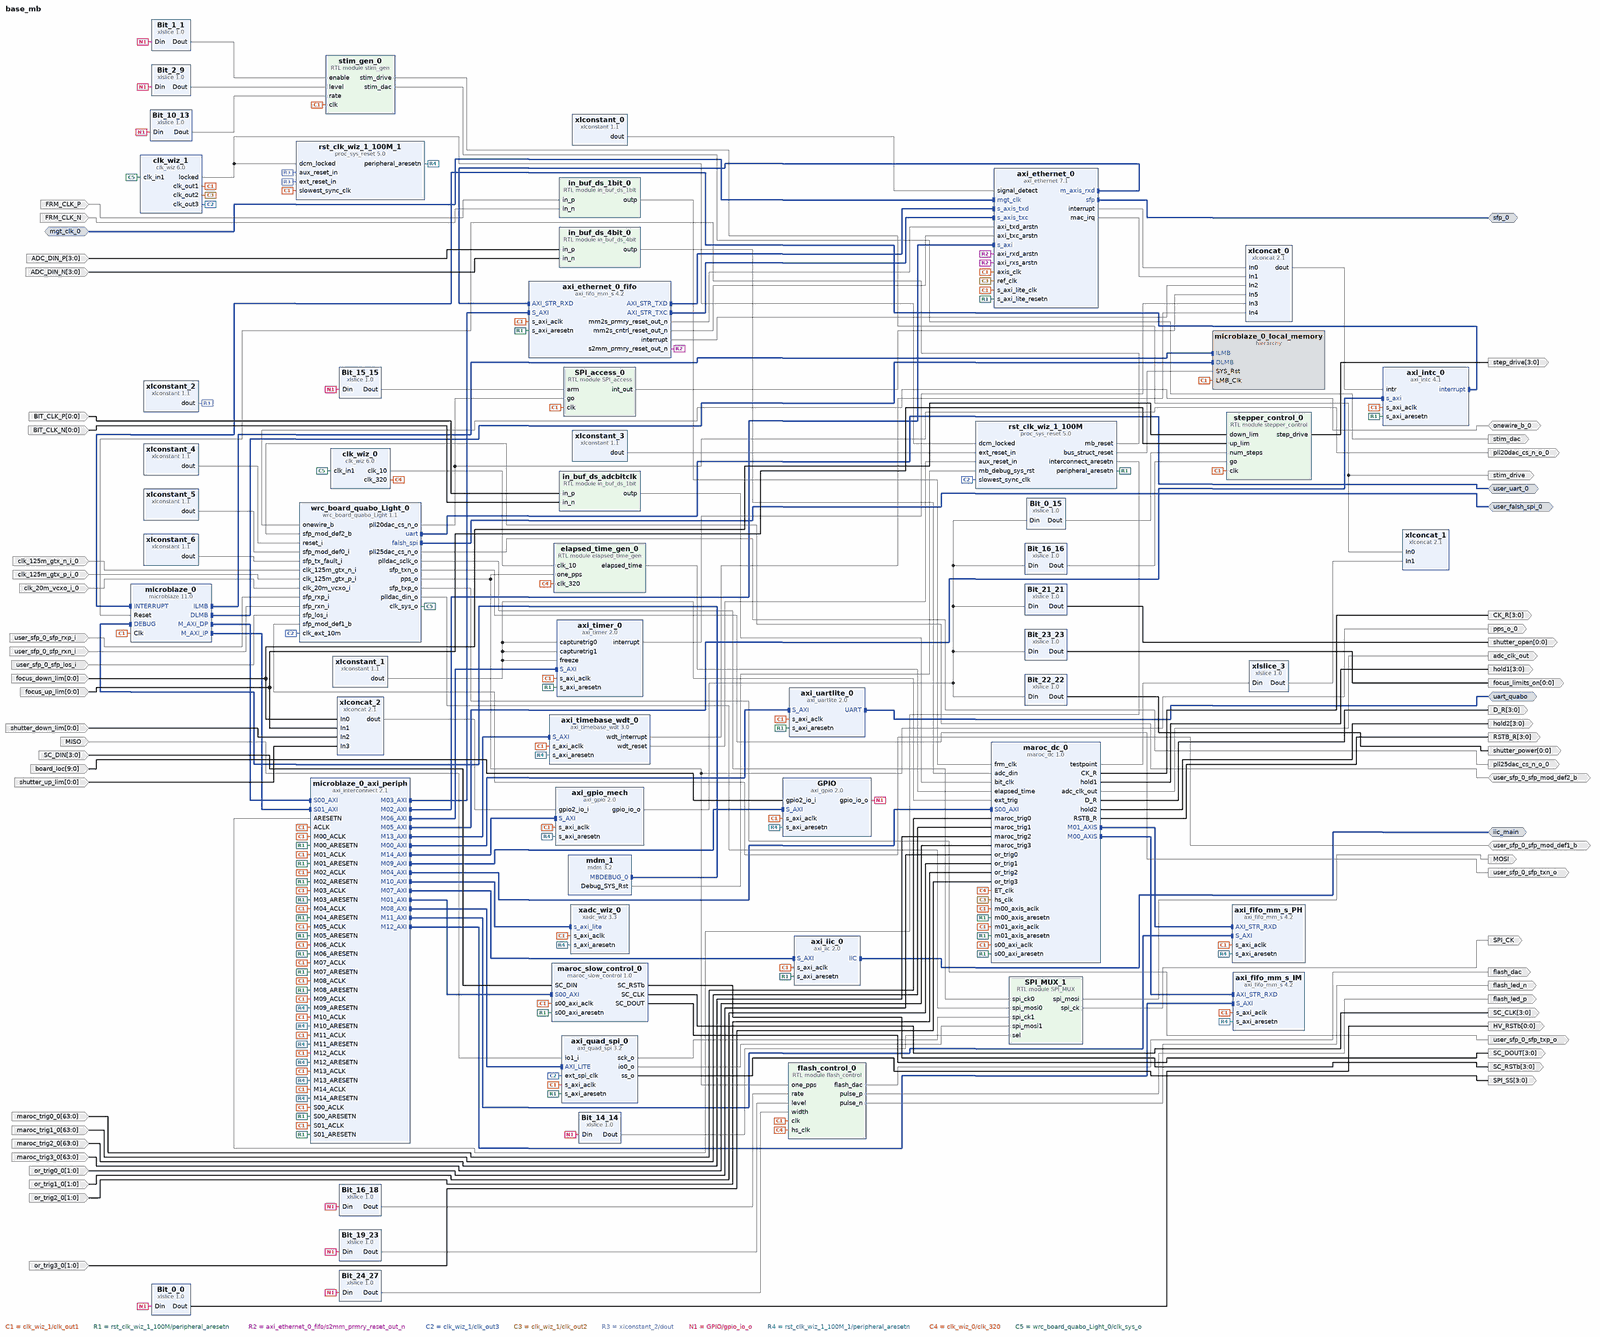
[diagram p0: block diagram of the top level, whole]
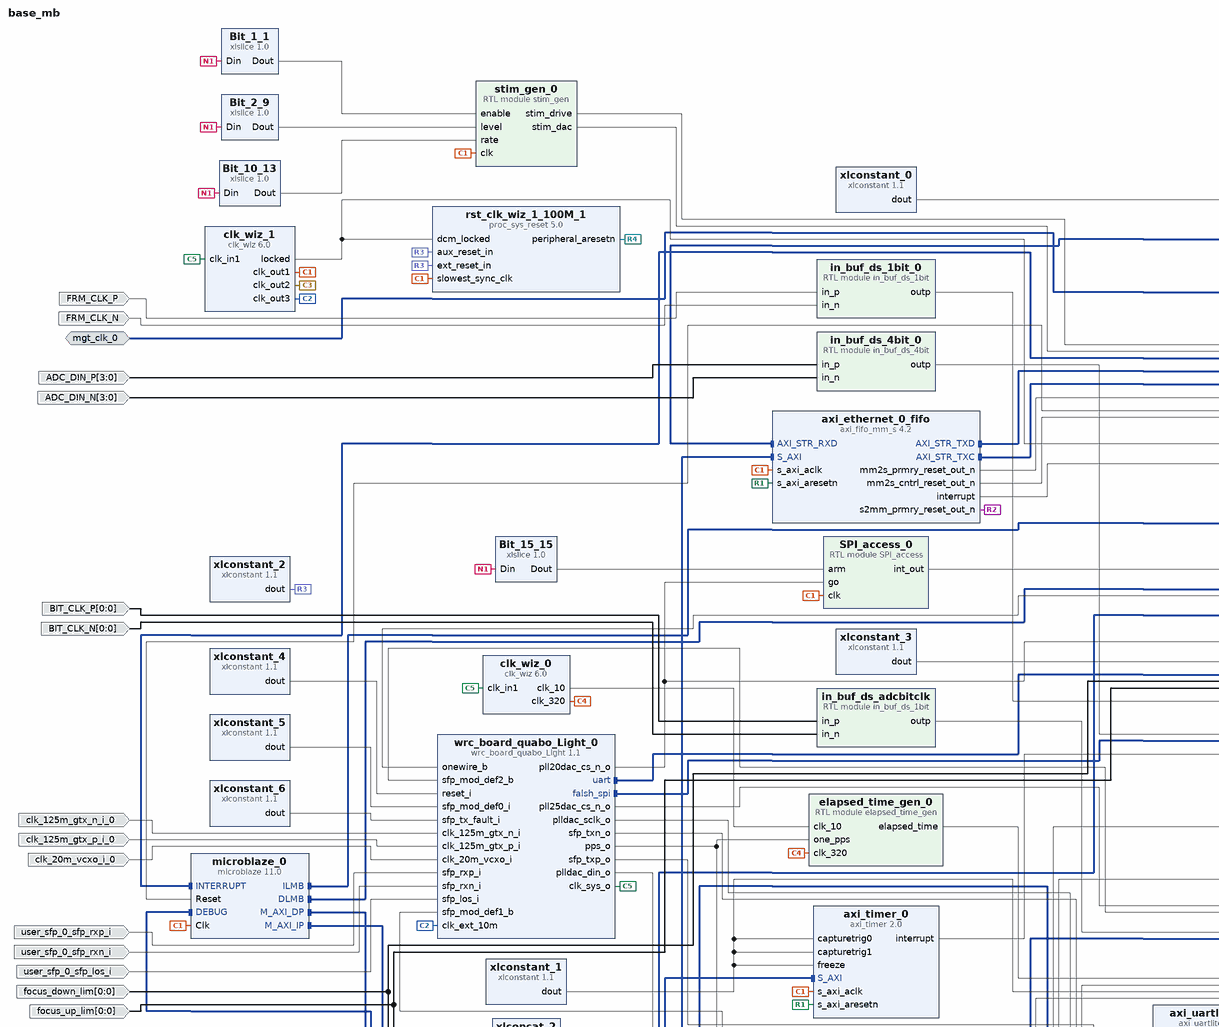
[diagram p1: block diagram of the top level, upper left part]
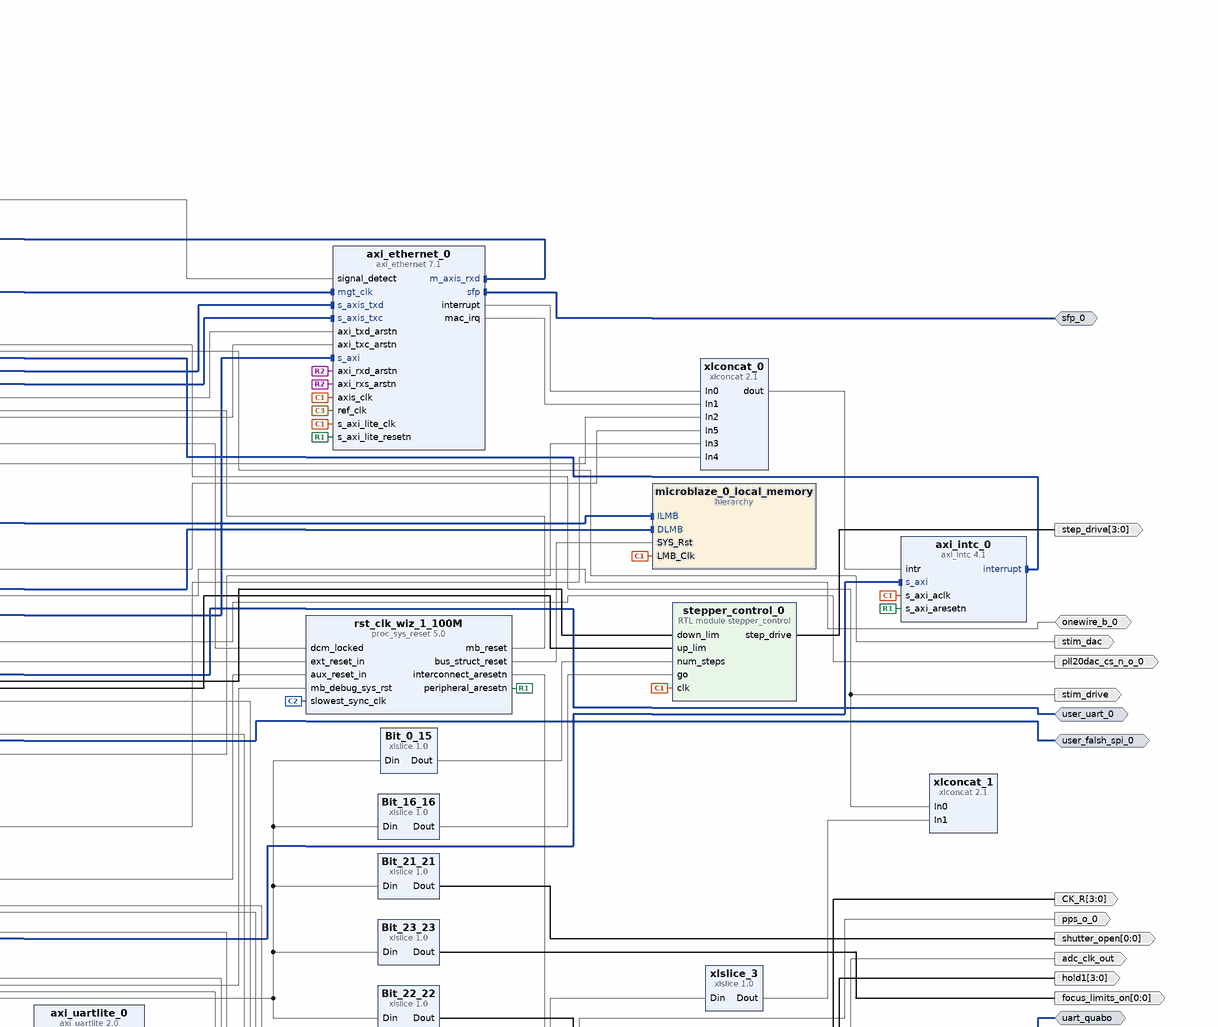
[diagram p2: block diagram of the top level, upper right part]
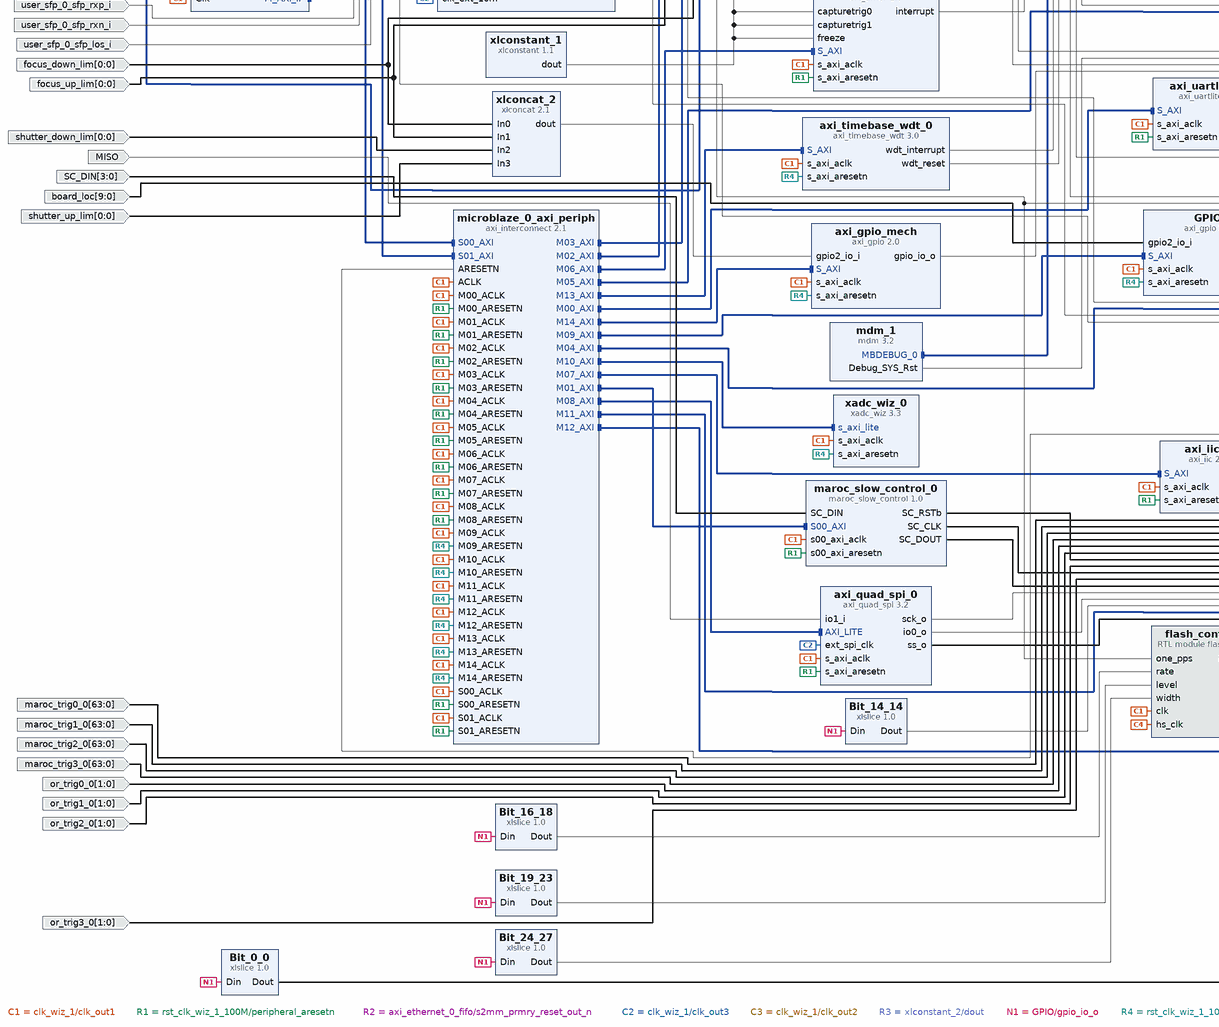
[diagram p3: block diagram of the top level, lower left part]
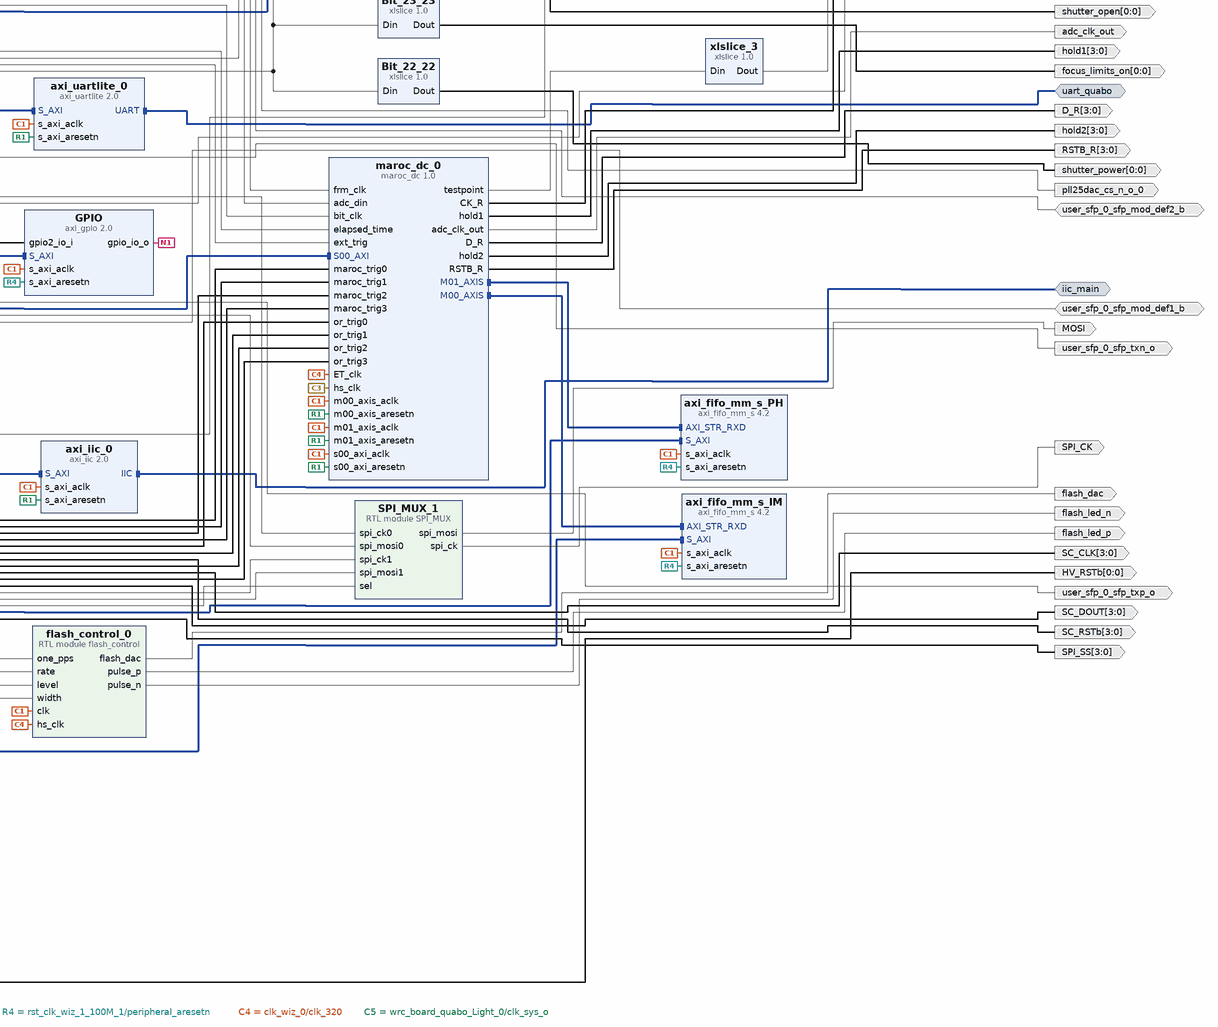
[diagram p4: block diagram of the top level, lower right part]
# Vivado block design base_mb, xc7k160tffg676-1, Vivado 2018.3_AR71948
create_bd_design base_mb

create_bd_intf_port -mode Slave -vlnv xilinx.com:interface:diff_clock_rtl:1.0 mgt_clk_0
create_bd_intf_port -mode Master -vlnv xilinx.com:interface:iic_rtl:1.0 iic_main
create_bd_intf_port -mode Master -vlnv xilinx.com:interface:sfp_rtl:1.0 sfp_0
create_bd_intf_port -mode Master -vlnv xilinx.com:interface:uart_rtl:1.0 uart_quabo
create_bd_intf_port -mode Master -vlnv user.org:user:falsh_spi_rtl:1.1 user_falsh_spi_0
create_bd_intf_port -mode Master -vlnv user.org:user:uart_rtl:1.0 user_uart_0
create_bd_port -dir I MISO
create_bd_port -dir O MOSI
create_bd_port -dir O SPI_CK
create_bd_port -dir O -from 3 -to 0 SC_RSTb
create_bd_port -dir O -from 3 -to 0 SC_DOUT
create_bd_port -dir O -from 3 -to 0 -type clk SC_CLK
create_bd_port -dir O -from 3 -to 0 hold1
create_bd_port -dir O -from 3 -to 0 hold2
create_bd_port -dir O -from 3 -to 0 CK_R
create_bd_port -dir O -from 3 -to 0 RSTB_R
create_bd_port -dir O -from 3 -to 0 D_R
create_bd_port -dir O adc_clk_out
create_bd_port -dir I -from 3 -to 0 SC_DIN
create_bd_port -dir I -from 63 -to 0 maroc_trig0_0
create_bd_port -dir I -from 63 -to 0 maroc_trig1_0
create_bd_port -dir I -from 63 -to 0 maroc_trig2_0
create_bd_port -dir I -from 63 -to 0 maroc_trig3_0
create_bd_port -dir I -from 1 -to 0 or_trig0_0
create_bd_port -dir I -from 1 -to 0 or_trig1_0
create_bd_port -dir I -from 1 -to 0 or_trig2_0
create_bd_port -dir I -from 1 -to 0 or_trig3_0
create_bd_port -dir O -from 0 -to 0 HV_RSTb
create_bd_port -dir O stim_drive
create_bd_port -dir O stim_dac
create_bd_port -dir I -from 9 -to 0 board_loc
create_bd_port -dir I FRM_CLK_P
create_bd_port -dir I FRM_CLK_N
create_bd_port -dir I -from 3 -to 0 ADC_DIN_P
create_bd_port -dir I -from 3 -to 0 ADC_DIN_N
create_bd_port -dir I -from 0 -to 0 -type clk BIT_CLK_P
set_property -dict {CONFIG.FREQ_HZ 60000000} [get_bd_ports BIT_CLK_P]
create_bd_port -dir I -from 0 -to 0 -type clk BIT_CLK_N
set_property -dict {CONFIG.FREQ_HZ 60000000} [get_bd_ports BIT_CLK_N]
create_bd_port -dir I clk_125m_gtx_n_i_0
create_bd_port -dir I clk_125m_gtx_p_i_0
create_bd_port -dir I clk_20m_vcxo_i_0
create_bd_port -dir IO onewire_b_0
create_bd_port -dir O pll20dac_cs_n_o_0
create_bd_port -dir O pll25dac_cs_n_o_0
create_bd_port -dir O pps_o_0
create_bd_port -dir O -from 3 -to 0 SPI_SS
create_bd_port -dir O user_sfp_0_sfp_txn_o
create_bd_port -dir I user_sfp_0_sfp_rxp_i
create_bd_port -dir O user_sfp_0_sfp_txp_o
create_bd_port -dir I user_sfp_0_sfp_rxn_i
create_bd_port -dir IO user_sfp_0_sfp_mod_def2_b
create_bd_port -dir IO user_sfp_0_sfp_mod_def1_b
create_bd_port -dir I user_sfp_0_sfp_los_i
create_bd_port -dir O flash_dac
create_bd_port -dir O flash_led_p
create_bd_port -dir O flash_led_n
create_bd_port -dir O -from 0 -to 0 shutter_open
create_bd_port -dir O -from 0 -to 0 shutter_power
create_bd_port -dir O -from 0 -to 0 focus_limits_on
create_bd_port -dir O -from 3 -to 0 step_drive
create_bd_port -dir I -from 0 -to 0 focus_down_lim
create_bd_port -dir I -from 0 -to 0 focus_up_lim
create_bd_port -dir I -from 0 -to 0 shutter_down_lim
create_bd_port -dir I -from 0 -to 0 shutter_up_lim

create_bd_cell -type hier microblaze_0_local_memory
create_bd_cell -type ip -vlnv xilinx.com:ip:xlconcat:2.1 xlconcat_0
set_property -dict {CONFIG.NUM_PORTS 6 CONFIG.dout_width 6} [get_bd_cells xlconcat_0]
create_bd_cell -type ip -vlnv xilinx.com:ip:xlslice:1.0 Bit_0_0
set_property -dict {CONFIG.DIN_FROM 0 CONFIG.DIN_TO 0 CONFIG.DIN_WIDTH 32} [get_bd_cells Bit_0_0]
create_bd_cell -type ip -vlnv xilinx.com:ip:xlslice:1.0 Bit_1_1
set_property -dict {CONFIG.DIN_FROM 1 CONFIG.DIN_TO 1 CONFIG.DIN_WIDTH 32 CONFIG.DOUT_WIDTH 1} [get_bd_cells Bit_1_1]
create_bd_cell -type ip -vlnv xilinx.com:ip:xlslice:1.0 Bit_2_9
set_property -dict {CONFIG.DIN_FROM 9 CONFIG.DIN_TO 2 CONFIG.DIN_WIDTH 32 CONFIG.DOUT_WIDTH 8} [get_bd_cells Bit_2_9]
create_bd_cell -type ip -vlnv xilinx.com:ip:xlslice:1.0 xlslice_3
set_property -dict {CONFIG.DIN_FROM 5 CONFIG.DIN_TO 3 CONFIG.DIN_WIDTH 6 CONFIG.DOUT_WIDTH 3} [get_bd_cells xlslice_3]
create_bd_cell -type module -reference in_buf_ds_1bit in_buf_ds_1bit_0
create_bd_cell -type module -reference in_buf_ds_4bit in_buf_ds_4bit_0
create_bd_cell -type module -reference elapsed_time_gen elapsed_time_gen_0
create_bd_cell -type module -reference in_buf_ds_1bit in_buf_ds_adcbitclk
create_bd_cell -type ip -vlnv xilinx.com:ip:xlconcat:2.1 xlconcat_1
set_property -dict {CONFIG.IN0_WIDTH 1 CONFIG.IN1_WIDTH 3} [get_bd_cells xlconcat_1]
create_bd_cell -type module -reference stim_gen stim_gen_0
create_bd_cell -type ip -vlnv xilinx.com:ip:xlslice:1.0 Bit_10_13
set_property -dict {CONFIG.DIN_FROM 13 CONFIG.DIN_TO 10 CONFIG.DIN_WIDTH 32 CONFIG.DOUT_WIDTH 4} [get_bd_cells Bit_10_13]
create_bd_cell -type ip -vlnv xilinx.com:ip:axi_ethernet:7.1 axi_ethernet_0
set_property -dict {CONFIG.PHY_TYPE 1000BaseX} [get_bd_cells axi_ethernet_0]
create_bd_cell -type ip -vlnv xilinx.com:ip:axi_fifo_mm_s:4.2 axi_ethernet_0_fifo
set_property -dict [list \
  CONFIG.C_HAS_AXIS_TKEEP true \
  CONFIG.C_RX_FIFO_DEPTH 4096 \
  CONFIG.C_RX_FIFO_PE_THRESHOLD 10 \
  CONFIG.C_RX_FIFO_PF_THRESHOLD 4000 \
  CONFIG.C_TX_FIFO_DEPTH 4096 \
  CONFIG.C_TX_FIFO_PE_THRESHOLD 10 \
  CONFIG.C_TX_FIFO_PF_THRESHOLD 4000 \
] [get_bd_cells axi_ethernet_0_fifo]
create_bd_cell -type ip -vlnv xilinx.com:ip:axi_fifo_mm_s:4.2 axi_fifo_mm_s_PH
set_property -dict [list \
  CONFIG.C_RX_FIFO_DEPTH 4096 \
  CONFIG.C_RX_FIFO_PF_THRESHOLD 3840 \
  CONFIG.C_USE_TX_CTRL 0 \
  CONFIG.C_USE_TX_DATA 0 \
] [get_bd_cells axi_fifo_mm_s_PH]
create_bd_cell -type ip -vlnv xilinx.com:ip:axi_fifo_mm_s:4.2 axi_fifo_mm_s_IM
set_property -dict [list \
  CONFIG.C_RX_FIFO_DEPTH 4096 \
  CONFIG.C_RX_FIFO_PF_THRESHOLD 3840 \
  CONFIG.C_USE_TX_CTRL 0 \
  CONFIG.C_USE_TX_DATA 0 \
] [get_bd_cells axi_fifo_mm_s_IM]
create_bd_cell -type ip -vlnv xilinx.com:ip:axi_gpio:2.0 GPIO
set_property -dict [list \
  CONFIG.C_ALL_INPUTS_2 1 \
  CONFIG.C_ALL_OUTPUTS 1 \
  CONFIG.C_GPIO2_WIDTH 10 \
  CONFIG.C_GPIO_WIDTH 32 \
  CONFIG.C_IS_DUAL 1 \
] [get_bd_cells GPIO]
create_bd_cell -type ip -vlnv xilinx.com:ip:axi_iic:2.0 axi_iic_0
set_property -dict {CONFIG.IIC_BOARD_INTERFACE Custom CONFIG.USE_BOARD_FLOW true} [get_bd_cells axi_iic_0]
create_bd_cell -type ip -vlnv xilinx.com:ip:axi_intc:4.1 axi_intc_0
create_bd_cell -type ip -vlnv xilinx.com:ip:axi_quad_spi:3.2 axi_quad_spi_0
set_property -dict [list \
  CONFIG.C_FIFO_DEPTH 16 \
  CONFIG.C_NUM_SS_BITS 4 \
  CONFIG.C_S_AXI4_ID_WIDTH 0 \
  CONFIG.C_USE_STARTUP 0 \
  CONFIG.FIFO_INCLUDED 0 \
] [get_bd_cells axi_quad_spi_0]
create_bd_cell -type ip -vlnv xilinx.com:ip:axi_timebase_wdt:3.0 axi_timebase_wdt_0
create_bd_cell -type ip -vlnv xilinx.com:ip:axi_timer:2.0 axi_timer_0
set_property -dict {CONFIG.enable_timer2 0} [get_bd_cells axi_timer_0]
create_bd_cell -type ip -vlnv xilinx.com:ip:axi_uartlite:2.0 axi_uartlite_0
set_property -dict [list \
  CONFIG.C_BAUDRATE 115200 \
  CONFIG.UARTLITE_BOARD_INTERFACE Custom \
  CONFIG.USE_BOARD_FLOW true \
] [get_bd_cells axi_uartlite_0]
create_bd_cell -type ip -vlnv xilinx.com:ip:clk_wiz:6.0 clk_wiz_0
set_property -dict [list \
  CONFIG.CLKIN1_JITTER_PS 100.000 \
  CONFIG.CLKIN1_UI_JITTER 100.000 \
  CONFIG.CLKIN2_JITTER_PS 100.000 \
  CONFIG.CLKIN2_UI_JITTER 100.000 \
  CONFIG.CLKOUT1_JITTER 122.176 \
  CONFIG.CLKOUT1_PHASE_ERROR 113.630 \
  CONFIG.CLKOUT1_REQUESTED_OUT_FREQ 312.5 \
  CONFIG.CLKOUT2_JITTER 165.729 \
  CONFIG.CLKOUT2_PHASE_ERROR 113.630 \
  CONFIG.CLKOUT2_REQUESTED_OUT_FREQ 62.5000 \
  CONFIG.CLKOUT2_REQUESTED_PHASE 0.000 \
  CONFIG.CLKOUT2_USED true \
  CONFIG.CLKOUT3_JITTER 877.934 \
  CONFIG.CLKOUT3_PHASE_ERROR 874.060 \
  CONFIG.CLKOUT3_REQUESTED_OUT_FREQ 100.000 \
  CONFIG.CLKOUT3_USED false \
  CONFIG.CLK_OUT1_PORT clk_320 \
  CONFIG.CLK_OUT2_PORT clk_10 \
  CONFIG.CLK_OUT3_PORT clk_out3 \
  CONFIG.JITTER_OPTIONS PS \
  CONFIG.MMCM_CLKFBOUT_MULT_F 15.000 \
  CONFIG.MMCM_CLKIN1_PERIOD 16.000 \
  CONFIG.MMCM_CLKIN2_PERIOD 10.0 \
  CONFIG.MMCM_CLKOUT0_DIVIDE_F 3.000 \
  CONFIG.MMCM_CLKOUT1_DIVIDE 15 \
  CONFIG.MMCM_CLKOUT1_PHASE 0.000 \
  CONFIG.MMCM_CLKOUT2_DIVIDE 1 \
  CONFIG.MMCM_DIVCLK_DIVIDE 1 \
  CONFIG.MMCM_REF_JITTER1 0.006 \
  CONFIG.MMCM_REF_JITTER2 0.010 \
  CONFIG.NUM_OUT_CLKS 2 \
  CONFIG.PRIM_IN_FREQ 62.5 \
  CONFIG.PRIM_SOURCE Single_ended_clock_capable_pin \
  CONFIG.USE_INCLK_STOPPED true \
  CONFIG.USE_RESET false \
] [get_bd_cells clk_wiz_0]
create_bd_cell -type ip -vlnv xilinx.com:ip:clk_wiz:6.0 clk_wiz_1
set_property -dict [list \
  CONFIG.CLKIN1_JITTER_PS 160.0 \
  CONFIG.CLKOUT1_JITTER 146.398 \
  CONFIG.CLKOUT1_PHASE_ERROR 117.286 \
  CONFIG.CLKOUT2_JITTER 128.566 \
  CONFIG.CLKOUT2_PHASE_ERROR 117.286 \
  CONFIG.CLKOUT2_REQUESTED_OUT_FREQ 200 \
  CONFIG.CLKOUT2_USED true \
  CONFIG.CLKOUT3_JITTER 247.343 \
  CONFIG.CLKOUT3_PHASE_ERROR 117.286 \
  CONFIG.CLKOUT3_REQUESTED_OUT_FREQ 10 \
  CONFIG.CLKOUT3_USED true \
  CONFIG.CLKOUT4_REQUESTED_OUT_FREQ 100.000 \
  CONFIG.MMCM_CLKFBOUT_MULT_F 16.000 \
  CONFIG.MMCM_CLKIN1_PERIOD 16.000 \
  CONFIG.MMCM_CLKIN2_PERIOD 10.0 \
  CONFIG.MMCM_CLKOUT1_DIVIDE 5 \
  CONFIG.MMCM_CLKOUT2_DIVIDE 100 \
  CONFIG.MMCM_DIVCLK_DIVIDE 1 \
  CONFIG.NUM_OUT_CLKS 3 \
  CONFIG.PRIM_IN_FREQ 62.5 \
  CONFIG.PRIM_SOURCE Single_ended_clock_capable_pin \
  CONFIG.USE_RESET false \
] [get_bd_cells clk_wiz_1]
create_bd_cell -type ip -vlnv xilinx.com:ip:mdm:3.2 mdm_1
create_bd_cell -type ip -vlnv xilinx.com:ip:microblaze:11.0 microblaze_0
set_property -dict [list \
  CONFIG.C_ADDR_TAG_BITS 0 \
  CONFIG.C_DCACHE_ADDR_TAG 0 \
  CONFIG.C_DEBUG_ENABLED 1 \
  CONFIG.C_D_AXI 1 \
  CONFIG.C_D_LMB 1 \
  CONFIG.C_I_AXI 1 \
  CONFIG.C_I_LMB 1 \
  CONFIG.C_USE_DCACHE 0 \
  CONFIG.C_USE_ICACHE 0 \
] [get_bd_cells microblaze_0]
create_bd_cell -type ip -vlnv xilinx.com:ip:axi_interconnect:2.1 microblaze_0_axi_periph
set_property -dict {CONFIG.NUM_MI 15 CONFIG.NUM_SI 2} [get_bd_cells microblaze_0_axi_periph]
create_bd_cell -type ip -vlnv xilinx.com:ip:proc_sys_reset:5.0 rst_clk_wiz_1_100M
set_property -dict {CONFIG.C_AUX_RESET_HIGH 1} [get_bd_cells rst_clk_wiz_1_100M]
create_bd_cell -type ip -vlnv xilinx.com:ip:proc_sys_reset:5.0 rst_clk_wiz_1_100M_1
create_bd_cell -type ip -vlnv xilinx.com:ip:xadc_wiz:3.3 xadc_wiz_0
set_property -dict [list \
  CONFIG.CHANNEL_ENABLE_TEMPERATURE true \
  CONFIG.CHANNEL_ENABLE_VBRAM true \
  CONFIG.CHANNEL_ENABLE_VCCAUX true \
  CONFIG.CHANNEL_ENABLE_VCCINT true \
  CONFIG.CHANNEL_ENABLE_VP_VN false \
  CONFIG.ENABLE_RESET false \
  CONFIG.EXTERNAL_MUX_CHANNEL VP_VN \
  CONFIG.INTERFACE_SELECTION Enable_AXI \
  CONFIG.OT_ALARM false \
  CONFIG.SEQUENCER_MODE Continuous \
  CONFIG.SINGLE_CHANNEL_SELECTION VCCINT \
  CONFIG.USER_TEMP_ALARM false \
  CONFIG.VCCAUX_ALARM false \
  CONFIG.VCCINT_ALARM false \
  CONFIG.XADC_STARUP_SELECTION channel_sequencer \
] [get_bd_cells xadc_wiz_0]
create_bd_cell -type ip -vlnv xilinx.com:ip:xlconstant:1.1 xlconstant_0
create_bd_cell -type ip -vlnv xilinx.com:ip:xlconstant:1.1 xlconstant_1
set_property -dict {CONFIG.CONST_VAL 0} [get_bd_cells xlconstant_1]
create_bd_cell -type ip -vlnv xilinx.com:ip:xlconstant:1.1 xlconstant_2
create_bd_cell -type ip -vlnv xilinx.com:ip:xlconstant:1.1 xlconstant_3
set_property -dict {CONFIG.CONST_VAL 1} [get_bd_cells xlconstant_3]
create_bd_cell -type ip -vlnv xilinx.com:user:maroc_dc:1.0 maroc_dc_0
create_bd_cell -type ip -vlnv xilinx.com:user:maroc_slow_control:1.0 maroc_slow_control_0
create_bd_cell -type ip -vlnv xilinx.com:ip:xlslice:1.0 Bit_14_14
set_property -dict {CONFIG.DIN_FROM 14 CONFIG.DIN_TO 14 CONFIG.DIN_WIDTH 32 CONFIG.DOUT_WIDTH 1} [get_bd_cells Bit_14_14]
create_bd_cell -type module -reference SPI_MUX SPI_MUX_1
create_bd_cell -type ip -vlnv xilinx.com:ip:xlslice:1.0 Bit_15_15
set_property -dict {CONFIG.DIN_FROM 15 CONFIG.DIN_TO 15 CONFIG.DIN_WIDTH 32 CONFIG.DOUT_WIDTH 1} [get_bd_cells Bit_15_15]
create_bd_cell -type ip -vlnv xilinx.com:ip:xlconstant:1.1 xlconstant_4
set_property -dict {CONFIG.CONST_VAL 1} [get_bd_cells xlconstant_4]
create_bd_cell -type ip -vlnv xilinx.com:ip:xlconstant:1.1 xlconstant_5
set_property -dict {CONFIG.CONST_VAL 0} [get_bd_cells xlconstant_5]
create_bd_cell -type ip -vlnv xilinx.com:ip:xlconstant:1.1 xlconstant_6
create_bd_cell -type module -reference SPI_access SPI_access_0
create_bd_cell -type ip -vlnv user.org:user:wrc_board_quabo_Light:1.1 wrc_board_quabo_Light_0
set_property -dict {CONFIG.g_dpram_initf /home/wei/Desktop/wrc_phy16_sdb.bram} [get_bd_cells wrc_board_quabo_Light_0]
create_bd_cell -type module -reference flash_control flash_control_0
create_bd_cell -type module -reference stepper_control stepper_control_0
create_bd_cell -type ip -vlnv xilinx.com:ip:xlslice:1.0 Bit_16_18
set_property -dict {CONFIG.DIN_FROM 18 CONFIG.DIN_TO 16 CONFIG.DIN_WIDTH 32 CONFIG.DOUT_WIDTH 3} [get_bd_cells Bit_16_18]
create_bd_cell -type ip -vlnv xilinx.com:ip:xlslice:1.0 Bit_19_23
set_property -dict {CONFIG.DIN_FROM 23 CONFIG.DIN_TO 19 CONFIG.DIN_WIDTH 32 CONFIG.DOUT_WIDTH 5} [get_bd_cells Bit_19_23]
create_bd_cell -type ip -vlnv xilinx.com:ip:xlslice:1.0 Bit_24_27
set_property -dict {CONFIG.DIN_FROM 27 CONFIG.DIN_TO 24 CONFIG.DIN_WIDTH 32 CONFIG.DOUT_WIDTH 4} [get_bd_cells Bit_24_27]
create_bd_cell -type ip -vlnv xilinx.com:ip:axi_gpio:2.0 axi_gpio_mech
set_property -dict [list \
  CONFIG.C_ALL_INPUTS_2 1 \
  CONFIG.C_ALL_OUTPUTS 1 \
  CONFIG.C_GPIO2_WIDTH 4 \
  CONFIG.C_IS_DUAL 1 \
] [get_bd_cells axi_gpio_mech]
create_bd_cell -type ip -vlnv xilinx.com:ip:xlslice:1.0 Bit_0_15
set_property -dict {CONFIG.DIN_FROM 15 CONFIG.DIN_TO 0 CONFIG.DIN_WIDTH 32 CONFIG.DOUT_WIDTH 16} [get_bd_cells Bit_0_15]
create_bd_cell -type ip -vlnv xilinx.com:ip:xlslice:1.0 Bit_16_16
set_property -dict {CONFIG.DIN_FROM 16 CONFIG.DIN_TO 16 CONFIG.DIN_WIDTH 32 CONFIG.DOUT_WIDTH 1} [get_bd_cells Bit_16_16]
create_bd_cell -type ip -vlnv xilinx.com:ip:xlconcat:2.1 xlconcat_2
set_property -dict {CONFIG.NUM_PORTS 4} [get_bd_cells xlconcat_2]
create_bd_cell -type ip -vlnv xilinx.com:ip:xlslice:1.0 Bit_21_21
set_property -dict {CONFIG.DIN_FROM 21 CONFIG.DIN_TO 21 CONFIG.DIN_WIDTH 32 CONFIG.DOUT_WIDTH 1} [get_bd_cells Bit_21_21]
create_bd_cell -type ip -vlnv xilinx.com:ip:xlslice:1.0 Bit_22_22
set_property -dict {CONFIG.DIN_FROM 22 CONFIG.DIN_TO 22 CONFIG.DIN_WIDTH 32 CONFIG.DOUT_WIDTH 1} [get_bd_cells Bit_22_22]
create_bd_cell -type ip -vlnv xilinx.com:ip:xlslice:1.0 Bit_23_23
set_property -dict {CONFIG.DIN_FROM 23 CONFIG.DIN_TO 23 CONFIG.DIN_WIDTH 32 CONFIG.DOUT_WIDTH 1} [get_bd_cells Bit_23_23]

# ---- hierarchy /microblaze_0_local_memory ----
current_bd_instance /microblaze_0_local_memory
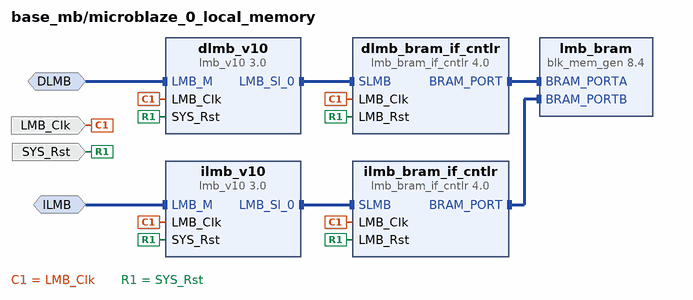
[diagram p5: block diagram inside /microblaze_0_local_memory]
create_bd_intf_pin -mode MirroredMaster -vlnv xilinx.com:interface:lmb_rtl:1.0 DLMB
create_bd_intf_pin -mode MirroredMaster -vlnv xilinx.com:interface:lmb_rtl:1.0 ILMB
create_bd_pin -dir I -type clk LMB_Clk
create_bd_pin -dir I -type rst SYS_Rst

create_bd_cell -type ip -vlnv xilinx.com:ip:lmb_v10:3.0 dlmb_v10
create_bd_cell -type ip -vlnv xilinx.com:ip:lmb_v10:3.0 ilmb_v10
create_bd_cell -type ip -vlnv xilinx.com:ip:lmb_bram_if_cntlr:4.0 dlmb_bram_if_cntlr
set_property -dict {CONFIG.C_ECC 0} [get_bd_cells dlmb_bram_if_cntlr]
create_bd_cell -type ip -vlnv xilinx.com:ip:lmb_bram_if_cntlr:4.0 ilmb_bram_if_cntlr
set_property -dict {CONFIG.C_ECC 0} [get_bd_cells ilmb_bram_if_cntlr]
create_bd_cell -type ip -vlnv xilinx.com:ip:blk_mem_gen:8.4 lmb_bram
set_property -dict [list \
  CONFIG.Enable_B Use_ENB_Pin \
  CONFIG.Memory_Type True_Dual_Port_RAM \
  CONFIG.Port_B_Clock 100 \
  CONFIG.Port_B_Enable_Rate 100 \
  CONFIG.Port_B_Write_Rate 50 \
  CONFIG.Use_RSTB_Pin true \
  CONFIG.use_bram_block BRAM_Controller \
] [get_bd_cells lmb_bram]

# ---- connections ----

current_bd_instance /microblaze_0_local_memory
connect_bd_intf_net -intf_net microblaze_0_dlmb_cntlr [get_bd_intf_pins dlmb_bram_if_cntlr/BRAM_PORT] [get_bd_intf_pins lmb_bram/BRAM_PORTA]
connect_bd_intf_net -intf_net microblaze_0_dlmb_bus [get_bd_intf_pins dlmb_v10/LMB_Sl_0] [get_bd_intf_pins dlmb_bram_if_cntlr/SLMB]
connect_bd_intf_net -intf_net microblaze_0_ilmb [get_bd_intf_pins ILMB] [get_bd_intf_pins ilmb_v10/LMB_M]
connect_bd_intf_net -intf_net microblaze_0_ilmb_bus [get_bd_intf_pins ilmb_v10/LMB_Sl_0] [get_bd_intf_pins ilmb_bram_if_cntlr/SLMB]
connect_bd_intf_net -intf_net microblaze_0_ilmb_cntlr [get_bd_intf_pins ilmb_bram_if_cntlr/BRAM_PORT] [get_bd_intf_pins lmb_bram/BRAM_PORTB]
connect_bd_intf_net -intf_net microblaze_0_dlmb [get_bd_intf_pins DLMB] [get_bd_intf_pins dlmb_v10/LMB_M]
connect_bd_net -net microblaze_0_Clk [get_bd_pins LMB_Clk] \
  [get_bd_pins dlmb_v10/LMB_Clk] [get_bd_pins ilmb_v10/LMB_Clk] [get_bd_pins dlmb_bram_if_cntlr/LMB_Clk] \
  [get_bd_pins ilmb_bram_if_cntlr/LMB_Clk]
connect_bd_net [get_bd_pins SYS_Rst] \
  [get_bd_pins dlmb_v10/SYS_Rst] [get_bd_pins ilmb_v10/SYS_Rst] [get_bd_pins dlmb_bram_if_cntlr/LMB_Rst] \
  [get_bd_pins ilmb_bram_if_cntlr/LMB_Rst]
set_property HDL_ATTRIBUTE.BMM_INFO_ADDRESS_SPACE {byte  0x00000000 32 > base_mb microblaze_0_local_memory/lmb_bram} [get_bd_cells dlmb_bram_if_cntlr]
set_property HDL_ATTRIBUTE.KEEP_HIERARCHY yes [get_bd_cells dlmb_bram_if_cntlr]

current_bd_instance /
connect_bd_intf_net [get_bd_intf_pins axi_fifo_mm_s_PH/AXI_STR_RXD] [get_bd_intf_pins maroc_dc_0/M01_AXIS]
connect_bd_intf_net [get_bd_intf_pins mdm_1/MBDEBUG_0] [get_bd_intf_pins microblaze_0/DEBUG]
connect_bd_intf_net [get_bd_intf_ports user_uart_0] [get_bd_intf_pins wrc_board_quabo_Light_0/uart]
connect_bd_intf_net [get_bd_intf_pins microblaze_0_axi_periph/M02_AXI] [get_bd_intf_pins axi_ethernet_0/s_axi]
connect_bd_intf_net [get_bd_intf_pins axi_ethernet_0_fifo/AXI_STR_TXD] [get_bd_intf_pins axi_ethernet_0/s_axis_txd]
connect_bd_intf_net [get_bd_intf_ports uart_quabo] [get_bd_intf_pins axi_uartlite_0/UART]
connect_bd_intf_net [get_bd_intf_ports sfp_0] [get_bd_intf_pins axi_ethernet_0/sfp]
connect_bd_intf_net [get_bd_intf_pins microblaze_0/ILMB] [get_bd_intf_pins microblaze_0_local_memory/ILMB]
connect_bd_intf_net [get_bd_intf_pins microblaze_0_axi_periph/M09_AXI] [get_bd_intf_pins GPIO/S_AXI]
connect_bd_intf_net [get_bd_intf_pins microblaze_0/M_AXI_DP] [get_bd_intf_pins microblaze_0_axi_periph/S00_AXI]
connect_bd_intf_net [get_bd_intf_pins microblaze_0_axi_periph/M01_AXI] [get_bd_intf_pins maroc_slow_control_0/S00_AXI]
connect_bd_intf_net [get_bd_intf_pins axi_ethernet_0_fifo/AXI_STR_TXC] [get_bd_intf_pins axi_ethernet_0/s_axis_txc]
connect_bd_intf_net [get_bd_intf_pins axi_intc_0/interrupt] [get_bd_intf_pins microblaze_0/INTERRUPT]
connect_bd_intf_net [get_bd_intf_pins microblaze_0_axi_periph/M03_AXI] [get_bd_intf_pins axi_ethernet_0_fifo/S_AXI]
connect_bd_intf_net [get_bd_intf_pins microblaze_0_axi_periph/M07_AXI] [get_bd_intf_pins axi_iic_0/S_AXI]
connect_bd_intf_net [get_bd_intf_pins microblaze_0_axi_periph/M05_AXI] [get_bd_intf_pins axi_intc_0/s_axi]
connect_bd_intf_net [get_bd_intf_pins microblaze_0/M_AXI_IP] [get_bd_intf_pins microblaze_0_axi_periph/S01_AXI]
connect_bd_intf_net -intf_net mgt_clk_0_1 [get_bd_intf_ports mgt_clk_0] [get_bd_intf_pins axi_ethernet_0/mgt_clk]
connect_bd_intf_net [get_bd_intf_pins microblaze_0_axi_periph/M10_AXI] [get_bd_intf_pins xadc_wiz_0/s_axi_lite]
connect_bd_intf_net [get_bd_intf_pins microblaze_0_axi_periph/M04_AXI] [get_bd_intf_pins maroc_dc_0/S00_AXI]
connect_bd_intf_net [get_bd_intf_pins microblaze_0_axi_periph/M13_AXI] [get_bd_intf_pins axi_timebase_wdt_0/S_AXI]
connect_bd_intf_net [get_bd_intf_pins axi_ethernet_0_fifo/AXI_STR_RXD] [get_bd_intf_pins axi_ethernet_0/m_axis_rxd]
connect_bd_intf_net [get_bd_intf_pins microblaze_0/DLMB] [get_bd_intf_pins microblaze_0_local_memory/DLMB]
connect_bd_intf_net [get_bd_intf_ports iic_main] [get_bd_intf_pins axi_iic_0/IIC]
connect_bd_intf_net [get_bd_intf_pins microblaze_0_axi_periph/M00_AXI] [get_bd_intf_pins axi_uartlite_0/S_AXI]
connect_bd_intf_net [get_bd_intf_pins microblaze_0_axi_periph/M06_AXI] [get_bd_intf_pins axi_timer_0/S_AXI]
connect_bd_intf_net [get_bd_intf_pins microblaze_0_axi_periph/M08_AXI] [get_bd_intf_pins axi_quad_spi_0/AXI_LITE]
connect_bd_intf_net [get_bd_intf_ports user_falsh_spi_0] [get_bd_intf_pins wrc_board_quabo_Light_0/falsh_spi]
connect_bd_intf_net [get_bd_intf_pins axi_fifo_mm_s_IM/AXI_STR_RXD] [get_bd_intf_pins maroc_dc_0/M00_AXIS]
connect_bd_intf_net [get_bd_intf_pins microblaze_0_axi_periph/M11_AXI] [get_bd_intf_pins axi_fifo_mm_s_PH/S_AXI]
connect_bd_intf_net [get_bd_intf_pins microblaze_0_axi_periph/M12_AXI] [get_bd_intf_pins axi_fifo_mm_s_IM/S_AXI]
connect_bd_intf_net [get_bd_intf_pins microblaze_0_axi_periph/M14_AXI] [get_bd_intf_pins axi_gpio_mech/S_AXI]
connect_bd_net -net microblaze_0_Clk [get_bd_pins clk_wiz_1/clk_out1] \
  [get_bd_pins stim_gen_0/clk] [get_bd_pins microblaze_0_local_memory/LMB_Clk] [get_bd_pins axi_ethernet_0/s_axi_lite_clk] \
  [get_bd_pins axi_ethernet_0/axis_clk] [get_bd_pins axi_ethernet_0_fifo/s_axi_aclk] \
  [get_bd_pins axi_fifo_mm_s_PH/s_axi_aclk] [get_bd_pins axi_fifo_mm_s_IM/s_axi_aclk] [get_bd_pins GPIO/s_axi_aclk] \
  [get_bd_pins axi_iic_0/s_axi_aclk] [get_bd_pins axi_intc_0/s_axi_aclk] [get_bd_pins axi_quad_spi_0/s_axi_aclk] \
  [get_bd_pins axi_timebase_wdt_0/s_axi_aclk] [get_bd_pins axi_timer_0/s_axi_aclk] [get_bd_pins axi_uartlite_0/s_axi_aclk] \
  [get_bd_pins microblaze_0/Clk] [get_bd_pins microblaze_0_axi_periph/ACLK] [get_bd_pins microblaze_0_axi_periph/S00_ACLK] \
  [get_bd_pins microblaze_0_axi_periph/S01_ACLK] [get_bd_pins microblaze_0_axi_periph/M00_ACLK] \
  [get_bd_pins microblaze_0_axi_periph/M01_ACLK] [get_bd_pins microblaze_0_axi_periph/M02_ACLK] \
  [get_bd_pins microblaze_0_axi_periph/M03_ACLK] [get_bd_pins microblaze_0_axi_periph/M04_ACLK] \
  [get_bd_pins microblaze_0_axi_periph/M05_ACLK] [get_bd_pins microblaze_0_axi_periph/M06_ACLK] \
  [get_bd_pins microblaze_0_axi_periph/M07_ACLK] [get_bd_pins microblaze_0_axi_periph/M08_ACLK] \
  [get_bd_pins microblaze_0_axi_periph/M09_ACLK] [get_bd_pins microblaze_0_axi_periph/M10_ACLK] \
  [get_bd_pins microblaze_0_axi_periph/M11_ACLK] [get_bd_pins microblaze_0_axi_periph/M12_ACLK] \
  [get_bd_pins microblaze_0_axi_periph/M13_ACLK] [get_bd_pins rst_clk_wiz_1_100M_1/slowest_sync_clk] \
  [get_bd_pins xadc_wiz_0/s_axi_aclk] [get_bd_pins maroc_dc_0/s00_axi_aclk] [get_bd_pins maroc_dc_0/m00_axis_aclk] \
  [get_bd_pins maroc_dc_0/m01_axis_aclk] [get_bd_pins maroc_slow_control_0/s00_axi_aclk] [get_bd_pins SPI_access_0/clk] \
  [get_bd_pins flash_control_0/clk] [get_bd_pins stepper_control_0/clk] [get_bd_pins axi_gpio_mech/s_axi_aclk] \
  [get_bd_pins microblaze_0_axi_periph/M14_ACLK]
connect_bd_net [get_bd_pins clk_wiz_1/locked] [get_bd_pins rst_clk_wiz_1_100M/dcm_locked] [get_bd_pins rst_clk_wiz_1_100M_1/dcm_locked]
connect_bd_net [get_bd_pins rst_clk_wiz_1_100M/mb_reset] [get_bd_pins microblaze_0/Reset]
connect_bd_net [get_bd_pins rst_clk_wiz_1_100M/bus_struct_reset] [get_bd_pins microblaze_0_local_memory/SYS_Rst]
connect_bd_net [get_bd_pins mdm_1/Debug_SYS_Rst] [get_bd_pins rst_clk_wiz_1_100M/mb_debug_sys_rst]
connect_bd_net [get_bd_pins rst_clk_wiz_1_100M/peripheral_aresetn] \
  [get_bd_pins axi_ethernet_0/s_axi_lite_resetn] [get_bd_pins axi_ethernet_0_fifo/s_axi_aresetn] \
  [get_bd_pins axi_iic_0/s_axi_aresetn] [get_bd_pins axi_intc_0/s_axi_aresetn] [get_bd_pins axi_quad_spi_0/s_axi_aresetn] \
  [get_bd_pins axi_timer_0/s_axi_aresetn] [get_bd_pins axi_uartlite_0/s_axi_aresetn] \
  [get_bd_pins microblaze_0_axi_periph/S00_ARESETN] [get_bd_pins microblaze_0_axi_periph/S01_ARESETN] \
  [get_bd_pins microblaze_0_axi_periph/M00_ARESETN] [get_bd_pins microblaze_0_axi_periph/M01_ARESETN] \
  [get_bd_pins microblaze_0_axi_periph/M02_ARESETN] [get_bd_pins microblaze_0_axi_periph/M03_ARESETN] \
  [get_bd_pins microblaze_0_axi_periph/M04_ARESETN] [get_bd_pins microblaze_0_axi_periph/M05_ARESETN] \
  [get_bd_pins microblaze_0_axi_periph/M06_ARESETN] [get_bd_pins microblaze_0_axi_periph/M07_ARESETN] \
  [get_bd_pins microblaze_0_axi_periph/M08_ARESETN] [get_bd_pins maroc_dc_0/s00_axi_aresetn] \
  [get_bd_pins maroc_dc_0/m00_axis_aresetn] [get_bd_pins maroc_dc_0/m01_axis_aresetn] \
  [get_bd_pins maroc_slow_control_0/s00_axi_aresetn]
connect_bd_net [get_bd_pins rst_clk_wiz_1_100M/interconnect_aresetn] [get_bd_pins microblaze_0_axi_periph/ARESETN]
connect_bd_net [get_bd_pins axi_ethernet_0_fifo/mm2s_prmry_reset_out_n] [get_bd_pins axi_ethernet_0/axi_txd_arstn]
connect_bd_net [get_bd_pins axi_ethernet_0_fifo/mm2s_cntrl_reset_out_n] [get_bd_pins axi_ethernet_0/axi_txc_arstn]
connect_bd_net [get_bd_pins axi_ethernet_0_fifo/s2mm_prmry_reset_out_n] \
  [get_bd_pins axi_ethernet_0/axi_rxd_arstn] [get_bd_pins axi_ethernet_0/axi_rxs_arstn]
connect_bd_net [get_bd_pins xlconstant_0/dout] [get_bd_pins axi_ethernet_0/signal_detect]
connect_bd_net [get_bd_pins xlconstant_1/dout] \
  [get_bd_pins axi_timer_0/capturetrig0] [get_bd_pins axi_timer_0/capturetrig1] [get_bd_pins axi_timer_0/freeze] \
  [get_bd_pins maroc_dc_0/ext_trig]
connect_bd_net [get_bd_pins axi_timer_0/interrupt] [get_bd_pins xlconcat_0/In3]
connect_bd_net [get_bd_pins axi_ethernet_0/interrupt] [get_bd_pins xlconcat_0/In0]
connect_bd_net [get_bd_pins axi_ethernet_0/mac_irq] [get_bd_pins xlconcat_0/In1]
connect_bd_net [get_bd_pins axi_ethernet_0_fifo/interrupt] [get_bd_pins xlconcat_0/In2]
connect_bd_net -net io0_i_0_1 [get_bd_ports MISO] [get_bd_pins axi_quad_spi_0/io1_i]
connect_bd_net [get_bd_pins clk_wiz_1/clk_out3] \
  [get_bd_pins axi_quad_spi_0/ext_spi_clk] [get_bd_pins rst_clk_wiz_1_100M/slowest_sync_clk] \
  [get_bd_pins wrc_board_quabo_Light_0/clk_ext_10m]
connect_bd_net [get_bd_pins maroc_slow_control_0/SC_RSTb] [get_bd_ports SC_RSTb]
connect_bd_net [get_bd_pins maroc_slow_control_0/SC_DOUT] [get_bd_ports SC_DOUT]
connect_bd_net [get_bd_pins maroc_slow_control_0/SC_CLK] [get_bd_ports SC_CLK]
connect_bd_net [get_bd_pins maroc_dc_0/hold1] [get_bd_ports hold1]
connect_bd_net [get_bd_pins maroc_dc_0/hold2] [get_bd_ports hold2]
connect_bd_net [get_bd_pins maroc_dc_0/CK_R] [get_bd_ports CK_R]
connect_bd_net [get_bd_pins maroc_dc_0/RSTB_R] [get_bd_ports RSTB_R]
connect_bd_net [get_bd_pins maroc_dc_0/D_R] [get_bd_ports D_R]
connect_bd_net [get_bd_pins maroc_dc_0/adc_clk_out] [get_bd_ports adc_clk_out]
connect_bd_net -net SC_DIN_0_1 [get_bd_ports SC_DIN] [get_bd_pins maroc_slow_control_0/SC_DIN]
connect_bd_net -net maroc_trig0_0_1 [get_bd_ports maroc_trig0_0] [get_bd_pins maroc_dc_0/maroc_trig0]
connect_bd_net -net maroc_trig1_0_1 [get_bd_ports maroc_trig1_0] [get_bd_pins maroc_dc_0/maroc_trig1]
connect_bd_net -net maroc_trig2_0_1 [get_bd_ports maroc_trig2_0] [get_bd_pins maroc_dc_0/maroc_trig2]
connect_bd_net -net maroc_trig3_0_1 [get_bd_ports maroc_trig3_0] [get_bd_pins maroc_dc_0/maroc_trig3]
connect_bd_net -net or_trig0_0_1 [get_bd_ports or_trig0_0] [get_bd_pins maroc_dc_0/or_trig0]
connect_bd_net -net or_trig1_0_1 [get_bd_ports or_trig1_0] [get_bd_pins maroc_dc_0/or_trig1]
connect_bd_net -net or_trig2_0_1 [get_bd_ports or_trig2_0] [get_bd_pins maroc_dc_0/or_trig2]
connect_bd_net -net or_trig3_0_1 [get_bd_ports or_trig3_0] [get_bd_pins maroc_dc_0/or_trig3]
connect_bd_net [get_bd_pins clk_wiz_1/clk_out2] [get_bd_pins axi_ethernet_0/ref_clk] [get_bd_pins maroc_dc_0/hs_clk]
connect_bd_net [get_bd_pins xlconstant_2/dout] [get_bd_pins rst_clk_wiz_1_100M_1/ext_reset_in] [get_bd_pins rst_clk_wiz_1_100M_1/aux_reset_in]
connect_bd_net -net xlslice_0_Dout [get_bd_pins Bit_0_0/Dout] [get_bd_ports HV_RSTb]
connect_bd_net -net axi_gpio_0_gpio_io_o [get_bd_pins GPIO/gpio_io_o] \
  [get_bd_pins Bit_0_0/Din] [get_bd_pins Bit_1_1/Din] [get_bd_pins Bit_2_9/Din] [get_bd_pins Bit_10_13/Din] \
  [get_bd_pins Bit_14_14/Din] [get_bd_pins Bit_15_15/Din] [get_bd_pins Bit_19_23/Din] [get_bd_pins Bit_24_27/Din] \
  [get_bd_pins Bit_16_18/Din]
connect_bd_net [get_bd_pins rst_clk_wiz_1_100M_1/peripheral_aresetn] \
  [get_bd_pins axi_fifo_mm_s_PH/s_axi_aresetn] [get_bd_pins axi_fifo_mm_s_IM/s_axi_aresetn] [get_bd_pins GPIO/s_axi_aresetn] \
  [get_bd_pins axi_timebase_wdt_0/s_axi_aresetn] [get_bd_pins microblaze_0_axi_periph/M09_ARESETN] \
  [get_bd_pins microblaze_0_axi_periph/M10_ARESETN] [get_bd_pins microblaze_0_axi_periph/M11_ARESETN] \
  [get_bd_pins microblaze_0_axi_periph/M12_ARESETN] [get_bd_pins microblaze_0_axi_periph/M13_ARESETN] \
  [get_bd_pins xadc_wiz_0/s_axi_aresetn] [get_bd_pins axi_gpio_mech/s_axi_aresetn] \
  [get_bd_pins microblaze_0_axi_periph/M14_ARESETN]
connect_bd_net [get_bd_pins stim_gen_0/stim_drive] [get_bd_ports stim_drive] [get_bd_pins xlconcat_1/In0]
connect_bd_net [get_bd_pins stim_gen_0/stim_dac] [get_bd_ports stim_dac]
connect_bd_net -net xlslice_1_Dout [get_bd_pins Bit_1_1/Dout] [get_bd_pins stim_gen_0/enable]
connect_bd_net -net xlslice_2_Dout [get_bd_pins Bit_2_9/Dout] [get_bd_pins stim_gen_0/level]
connect_bd_net -net gpio2_io_i_0_1 [get_bd_ports board_loc] [get_bd_pins GPIO/gpio2_io_i]
connect_bd_net [get_bd_pins maroc_dc_0/testpoint] [get_bd_pins xlslice_3/Din]
connect_bd_net -net in_buf_ds_4bit_0_out [get_bd_pins in_buf_ds_4bit_0/outp] [get_bd_pins maroc_dc_0/adc_din]
connect_bd_net -net in_buf_ds_1bit_0_out [get_bd_pins in_buf_ds_1bit_0/outp] [get_bd_pins maroc_dc_0/frm_clk]
connect_bd_net [get_bd_pins clk_wiz_0/clk_320] \
  [get_bd_pins elapsed_time_gen_0/clk_320] [get_bd_pins maroc_dc_0/ET_clk] [get_bd_pins flash_control_0/hs_clk]
connect_bd_net -net in_p_0_1 [get_bd_ports FRM_CLK_P] [get_bd_pins in_buf_ds_1bit_0/in_p]
connect_bd_net -net in_n_0_1 [get_bd_ports FRM_CLK_N] [get_bd_pins in_buf_ds_1bit_0/in_n]
connect_bd_net -net in_p_1_1 [get_bd_ports ADC_DIN_P] [get_bd_pins in_buf_ds_4bit_0/in_p]
connect_bd_net -net in_n_1_1 [get_bd_ports ADC_DIN_N] [get_bd_pins in_buf_ds_4bit_0/in_n]
connect_bd_net [get_bd_pins elapsed_time_gen_0/elapsed_time] [get_bd_pins maroc_dc_0/elapsed_time]
connect_bd_net [get_bd_pins in_buf_ds_adcbitclk/outp] [get_bd_pins maroc_dc_0/bit_clk]
connect_bd_net [get_bd_ports BIT_CLK_P] [get_bd_pins in_buf_ds_adcbitclk/in_p]
connect_bd_net [get_bd_ports BIT_CLK_N] [get_bd_pins in_buf_ds_adcbitclk/in_n]
connect_bd_net [get_bd_pins axi_timebase_wdt_0/wdt_reset] [get_bd_pins rst_clk_wiz_1_100M/aux_reset_in]
connect_bd_net [get_bd_pins xlconcat_0/dout] [get_bd_pins axi_intc_0/intr]
connect_bd_net [get_bd_pins axi_timebase_wdt_0/wdt_interrupt] [get_bd_pins xlconcat_0/In4]
connect_bd_net [get_bd_pins xlslice_3/Dout] [get_bd_pins xlconcat_1/In1]
connect_bd_net -net xlslice_4_Dout [get_bd_pins Bit_10_13/Dout] [get_bd_pins stim_gen_0/rate]
connect_bd_net -net clk_125m_gtx_n_i_0_1 [get_bd_ports clk_125m_gtx_n_i_0] [get_bd_pins wrc_board_quabo_Light_0/clk_125m_gtx_n_i]
connect_bd_net -net clk_125m_gtx_p_i_0_1 [get_bd_ports clk_125m_gtx_p_i_0] [get_bd_pins wrc_board_quabo_Light_0/clk_125m_gtx_p_i]
connect_bd_net -net clk_20m_vcxo_i_0_1 [get_bd_ports clk_20m_vcxo_i_0] [get_bd_pins wrc_board_quabo_Light_0/clk_20m_vcxo_i]
connect_bd_net [get_bd_ports onewire_b_0] [get_bd_pins wrc_board_quabo_Light_0/onewire_b]
connect_bd_net [get_bd_pins wrc_board_quabo_Light_0/pll20dac_cs_n_o] [get_bd_ports pll20dac_cs_n_o_0] [get_bd_pins SPI_access_0/go]
connect_bd_net [get_bd_pins wrc_board_quabo_Light_0/pll25dac_cs_n_o] [get_bd_ports pll25dac_cs_n_o_0]
connect_bd_net [get_bd_pins wrc_board_quabo_Light_0/pps_o] \
  [get_bd_ports pps_o_0] [get_bd_pins elapsed_time_gen_0/one_pps] [get_bd_pins flash_control_0/one_pps]
connect_bd_net -net xlslice_5_Dout [get_bd_pins Bit_14_14/Dout] [get_bd_pins SPI_MUX_1/sel]
connect_bd_net [get_bd_pins axi_quad_spi_0/sck_o] [get_bd_pins SPI_MUX_1/spi_ck1]
connect_bd_net [get_bd_pins axi_quad_spi_0/io0_o] [get_bd_pins SPI_MUX_1/spi_mosi1]
connect_bd_net [get_bd_pins wrc_board_quabo_Light_0/plldac_sclk_o] [get_bd_pins SPI_MUX_1/spi_ck0]
connect_bd_net [get_bd_pins wrc_board_quabo_Light_0/plldac_din_o] [get_bd_pins SPI_MUX_1/spi_mosi0]
connect_bd_net [get_bd_pins SPI_MUX_1/spi_ck] [get_bd_ports SPI_CK]
connect_bd_net [get_bd_pins SPI_MUX_1/spi_mosi] [get_bd_ports MOSI]
connect_bd_net [get_bd_pins axi_quad_spi_0/ss_o] [get_bd_ports SPI_SS]
connect_bd_net [get_bd_pins SPI_access_0/int_out] [get_bd_pins xlconcat_0/In5]
connect_bd_net -net xlslice_6_Dout [get_bd_pins Bit_15_15/Dout] [get_bd_pins SPI_access_0/arm]
connect_bd_net [get_bd_pins xlconstant_3/dout] [get_bd_pins rst_clk_wiz_1_100M/ext_reset_in]
connect_bd_net [get_bd_pins xlconstant_4/dout] [get_bd_pins wrc_board_quabo_Light_0/reset_i]
connect_bd_net [get_bd_pins wrc_board_quabo_Light_0/sfp_txn_o] [get_bd_ports user_sfp_0_sfp_txn_o]
connect_bd_net -net sfp_rxp_i_0_1 [get_bd_ports user_sfp_0_sfp_rxp_i] [get_bd_pins wrc_board_quabo_Light_0/sfp_rxp_i]
connect_bd_net [get_bd_pins wrc_board_quabo_Light_0/sfp_txp_o] [get_bd_ports user_sfp_0_sfp_txp_o]
connect_bd_net -net sfp_rxn_i_0_1 [get_bd_ports user_sfp_0_sfp_rxn_i] [get_bd_pins wrc_board_quabo_Light_0/sfp_rxn_i]
connect_bd_net [get_bd_ports user_sfp_0_sfp_mod_def2_b] [get_bd_pins wrc_board_quabo_Light_0/sfp_mod_def2_b]
connect_bd_net [get_bd_ports user_sfp_0_sfp_mod_def1_b] [get_bd_pins wrc_board_quabo_Light_0/sfp_mod_def1_b]
connect_bd_net -net sfp_los_i_0_1 [get_bd_ports user_sfp_0_sfp_los_i] [get_bd_pins wrc_board_quabo_Light_0/sfp_los_i]
connect_bd_net [get_bd_pins xlconstant_5/dout] [get_bd_pins wrc_board_quabo_Light_0/sfp_mod_def0_i]
connect_bd_net [get_bd_pins xlconstant_6/dout] [get_bd_pins wrc_board_quabo_Light_0/sfp_tx_fault_i]
connect_bd_net [get_bd_pins wrc_board_quabo_Light_0/clk_sys_o] [get_bd_pins clk_wiz_1/clk_in1] [get_bd_pins clk_wiz_0/clk_in1]
connect_bd_net [get_bd_pins clk_wiz_0/clk_10] [get_bd_pins elapsed_time_gen_0/clk_10]
connect_bd_net -net xlslice_7_Dout [get_bd_pins Bit_16_18/Dout] [get_bd_pins flash_control_0/rate]
connect_bd_net -net Bit_16_19_Dout [get_bd_pins Bit_19_23/Dout] [get_bd_pins flash_control_0/level]
connect_bd_net -net Bit_19_24_Dout [get_bd_pins Bit_24_27/Dout] [get_bd_pins flash_control_0/width]
connect_bd_net [get_bd_pins flash_control_0/flash_dac] [get_bd_ports flash_dac]
connect_bd_net [get_bd_pins flash_control_0/pulse_p] [get_bd_ports flash_led_p]
connect_bd_net [get_bd_pins flash_control_0/pulse_n] [get_bd_ports flash_led_n]
connect_bd_net [get_bd_pins Bit_0_15/Dout] [get_bd_pins stepper_control_0/num_steps]
connect_bd_net [get_bd_pins Bit_16_16/Dout] [get_bd_pins stepper_control_0/go]
connect_bd_net -net axi_gpio_0_gpio_io_o1 [get_bd_pins axi_gpio_mech/gpio_io_o] \
  [get_bd_pins Bit_0_15/Din] [get_bd_pins Bit_16_16/Din] [get_bd_pins Bit_21_21/Din] [get_bd_pins Bit_22_22/Din] \
  [get_bd_pins Bit_23_23/Din]
connect_bd_net [get_bd_pins xlconcat_2/dout] [get_bd_pins axi_gpio_mech/gpio2_io_i]
connect_bd_net [get_bd_pins Bit_21_21/Dout] [get_bd_ports shutter_open]
connect_bd_net [get_bd_pins Bit_22_22/Dout] [get_bd_ports shutter_power]
connect_bd_net [get_bd_pins Bit_23_23/Dout] [get_bd_ports focus_limits_on]
connect_bd_net [get_bd_pins stepper_control_0/step_drive] [get_bd_ports step_drive]
connect_bd_net -net In0_0_1 [get_bd_ports focus_down_lim] [get_bd_pins xlconcat_2/In0] [get_bd_pins stepper_control_0/down_lim]
connect_bd_net -net In1_0_1 [get_bd_ports focus_up_lim] [get_bd_pins xlconcat_2/In1] [get_bd_pins stepper_control_0/up_lim]
connect_bd_net -net In2_0_1 [get_bd_ports shutter_down_lim] [get_bd_pins xlconcat_2/In2]
connect_bd_net -net In3_0_1 [get_bd_ports shutter_up_lim] [get_bd_pins xlconcat_2/In3]
set_property HDL_ATTRIBUTE.BMM_INFO_PROCESSOR {microblaze-le > base_mb microblaze_0_local_memory/dlmb_bram_if_cntlr} [get_bd_cells microblaze_0]
set_property HDL_ATTRIBUTE.KEEP_HIERARCHY yes [get_bd_cells microblaze_0]

# ---- address map ----
assign_bd_address -offset 0x00000000 -range 256K -target_address_space [get_bd_addr_spaces microblaze_0/Data] [get_bd_addr_segs microblaze_0_local_memory/dlmb_bram_if_cntlr/SLMB/Mem]
assign_bd_address -offset 0x40000000 -range 64K -target_address_space [get_bd_addr_spaces microblaze_0/Data] [get_bd_addr_segs GPIO/S_AXI/Reg]
assign_bd_address -offset 0x40010000 -range 64K -target_address_space [get_bd_addr_spaces microblaze_0/Data] [get_bd_addr_segs axi_gpio_mech/S_AXI/Reg]
assign_bd_address -offset 0x40600000 -range 64K -target_address_space [get_bd_addr_spaces microblaze_0/Data] [get_bd_addr_segs axi_uartlite_0/S_AXI/Reg]
assign_bd_address -offset 0x40800000 -range 64K -target_address_space [get_bd_addr_spaces microblaze_0/Data] [get_bd_addr_segs axi_iic_0/S_AXI/Reg]
assign_bd_address -offset 0x40C00000 -range 256K -target_address_space [get_bd_addr_spaces microblaze_0/Data] [get_bd_addr_segs axi_ethernet_0/s_axi/Reg0]
assign_bd_address -offset 0x41200000 -range 64K -target_address_space [get_bd_addr_spaces microblaze_0/Data] [get_bd_addr_segs axi_intc_0/S_AXI/Reg]
assign_bd_address -offset 0x41A00000 -range 64K -target_address_space [get_bd_addr_spaces microblaze_0/Data] [get_bd_addr_segs axi_timebase_wdt_0/S_AXI/Reg]
assign_bd_address -offset 0x41C00000 -range 64K -target_address_space [get_bd_addr_spaces microblaze_0/Data] [get_bd_addr_segs axi_timer_0/S_AXI/Reg]
assign_bd_address -offset 0x44A00000 -range 64K -target_address_space [get_bd_addr_spaces microblaze_0/Data] [get_bd_addr_segs axi_ethernet_0_fifo/S_AXI/Mem0]
assign_bd_address -offset 0x44A10000 -range 64K -target_address_space [get_bd_addr_spaces microblaze_0/Data] [get_bd_addr_segs axi_quad_spi_0/AXI_LITE/Reg]
assign_bd_address -offset 0x44A20000 -range 64K -target_address_space [get_bd_addr_spaces microblaze_0/Data] [get_bd_addr_segs maroc_slow_control_0/S00_AXI/S00_AXI_reg]
assign_bd_address -offset 0x44A30000 -range 64K -target_address_space [get_bd_addr_spaces microblaze_0/Data] [get_bd_addr_segs maroc_dc_0/S00_AXI/S00_AXI_reg]
assign_bd_address -offset 0x44A40000 -range 64K -target_address_space [get_bd_addr_spaces microblaze_0/Data] [get_bd_addr_segs xadc_wiz_0/s_axi_lite/Reg]
assign_bd_address -offset 0x44A50000 -range 64K -target_address_space [get_bd_addr_spaces microblaze_0/Data] [get_bd_addr_segs axi_fifo_mm_s_PH/S_AXI/Mem0]
assign_bd_address -offset 0x44A60000 -range 64K -target_address_space [get_bd_addr_spaces microblaze_0/Data] [get_bd_addr_segs axi_fifo_mm_s_IM/S_AXI/Mem0]
assign_bd_address -offset 0x00000000 -range 256K -target_address_space [get_bd_addr_spaces microblaze_0/Instruction] [get_bd_addr_segs microblaze_0_local_memory/ilmb_bram_if_cntlr/SLMB/Mem]
assign_bd_address -offset 0x40000000 -range 64K -target_address_space [get_bd_addr_spaces microblaze_0/Instruction] [get_bd_addr_segs GPIO/S_AXI/Reg]
assign_bd_address -offset 0x40010000 -range 64K -target_address_space [get_bd_addr_spaces microblaze_0/Instruction] [get_bd_addr_segs axi_gpio_mech/S_AXI/Reg]
assign_bd_address -offset 0x40600000 -range 64K -target_address_space [get_bd_addr_spaces microblaze_0/Instruction] [get_bd_addr_segs axi_uartlite_0/S_AXI/Reg]
assign_bd_address -offset 0x40800000 -range 64K -target_address_space [get_bd_addr_spaces microblaze_0/Instruction] [get_bd_addr_segs axi_iic_0/S_AXI/Reg]
assign_bd_address -offset 0x40C00000 -range 256K -target_address_space [get_bd_addr_spaces microblaze_0/Instruction] [get_bd_addr_segs axi_ethernet_0/s_axi/Reg0]
assign_bd_address -offset 0x41200000 -range 64K -target_address_space [get_bd_addr_spaces microblaze_0/Instruction] [get_bd_addr_segs axi_intc_0/S_AXI/Reg]
assign_bd_address -offset 0x41A00000 -range 64K -target_address_space [get_bd_addr_spaces microblaze_0/Instruction] [get_bd_addr_segs axi_timebase_wdt_0/S_AXI/Reg]
assign_bd_address -offset 0x41C00000 -range 64K -target_address_space [get_bd_addr_spaces microblaze_0/Instruction] [get_bd_addr_segs axi_timer_0/S_AXI/Reg]
assign_bd_address -offset 0x44A00000 -range 64K -target_address_space [get_bd_addr_spaces microblaze_0/Instruction] [get_bd_addr_segs axi_ethernet_0_fifo/S_AXI/Mem0]
assign_bd_address -offset 0x44A10000 -range 64K -target_address_space [get_bd_addr_spaces microblaze_0/Instruction] [get_bd_addr_segs axi_quad_spi_0/AXI_LITE/Reg]
assign_bd_address -offset 0x44A20000 -range 64K -target_address_space [get_bd_addr_spaces microblaze_0/Instruction] [get_bd_addr_segs maroc_slow_control_0/S00_AXI/S00_AXI_reg]
assign_bd_address -offset 0x44A30000 -range 64K -target_address_space [get_bd_addr_spaces microblaze_0/Instruction] [get_bd_addr_segs maroc_dc_0/S00_AXI/S00_AXI_reg]
assign_bd_address -offset 0x44A40000 -range 64K -target_address_space [get_bd_addr_spaces microblaze_0/Instruction] [get_bd_addr_segs xadc_wiz_0/s_axi_lite/Reg]
assign_bd_address -offset 0x44A50000 -range 64K -target_address_space [get_bd_addr_spaces microblaze_0/Instruction] [get_bd_addr_segs axi_fifo_mm_s_PH/S_AXI/Mem0]
assign_bd_address -offset 0x44A60000 -range 64K -target_address_space [get_bd_addr_spaces microblaze_0/Instruction] [get_bd_addr_segs axi_fifo_mm_s_IM/S_AXI/Mem0]

validate_bd_design
save_bd_design
